# EAGLE design ATmega168 Temp Sensor - Base Unit (EAGLE 5.06)
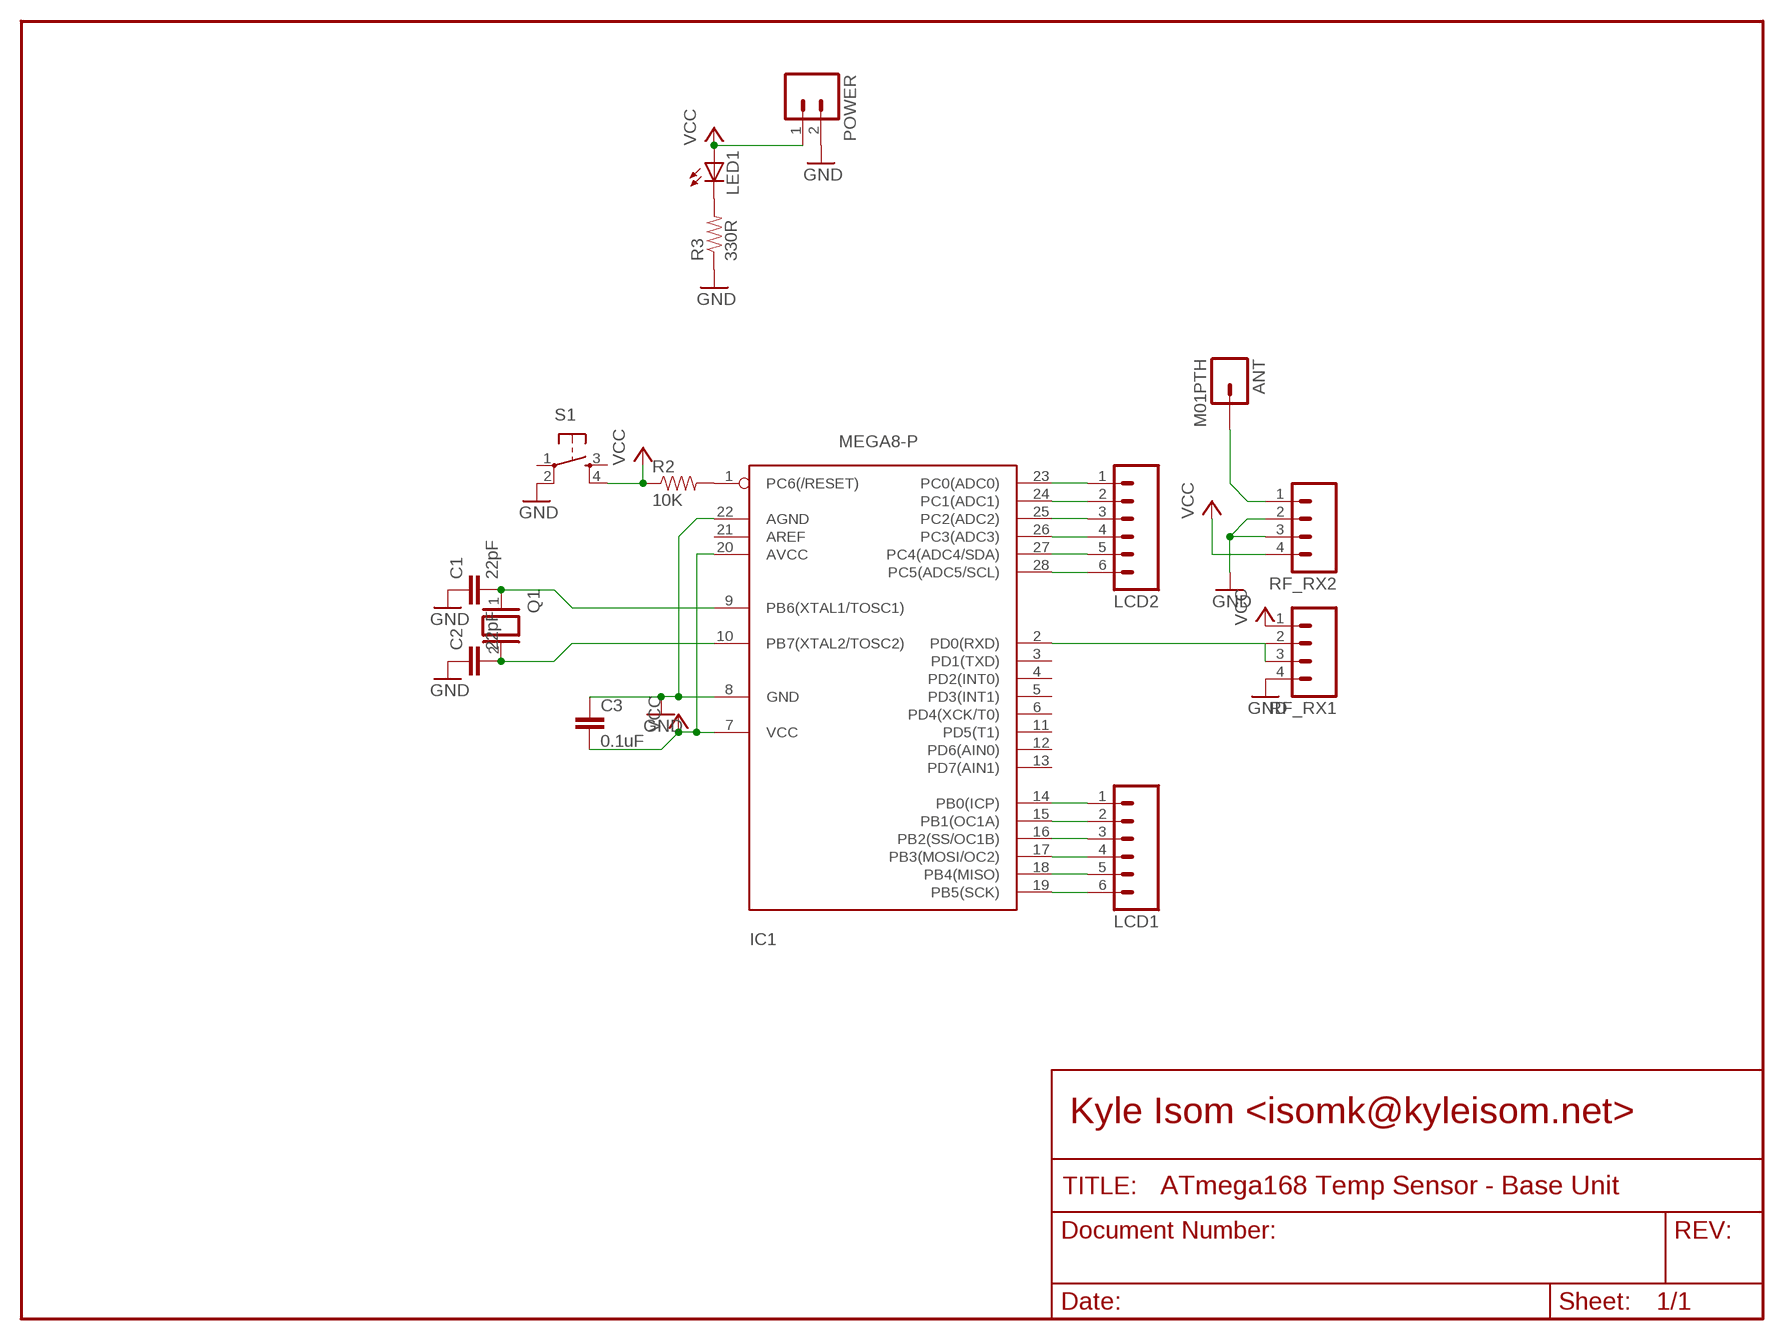
[diagram p0: schematic, sheet 1]

## Parts
ANT  M01PTH  [1X01]
C1  22pF  CAPPTH1  [CAP-PTH-5MM]
C2  22pF  CAPPTH1  [CAP-PTH-5MM]
C3  0.1uF  CAPPTH1  [CAP-PTH-5MM]
IC1  MEGA8-P  [DIL28-3]
LCD1  M06LOCK  [1X06_LOCK]
LCD2  M06LOCK  [1X06_LOCK]
LED1  LED3MM  [LED3MM]
POWER  M02LOCK  [1X02_LOCK]
Q1  XTAL/S  [QS]
R2  10K  RESISTORPTH1  [AXIAL-0.3]
R3  330R  RESISTORPTH1  [AXIAL-0.3]
RF_RX1  M04LOCK  [1X04_LOCK]
RF_RX2  M04LOCK  [1X04_LOCK]
S1  TAC_SWITCHPTH  [TACTILE-PTH]

## Nets
GND: C1.1 C2.1 C3.1 IC1.8(GND) IC1.22(AGND) POWER.2 R3.P$1 RF_RX1.4 RF_RX2.2 RF_RX2.3 S1.2
N$1: IC1.2(PD0(RXD)) RF_RX1.2 RF_RX1.3
N$2: C1.2 IC1.9(PB6(XTAL1/TOSC1)) Q1.1
N$3: C2.2 IC1.10(PB7(XTAL2/TOSC2)) Q1.2
N$4: ANT.1 RF_RX2.1
N$5: IC1.1(PC6(/RESET)) R2.P$2
N$6: IC1.28(PC5(ADC5/SCL)) LCD2.6
N$7: IC1.27(PC4(ADC4/SDA)) LCD2.5
N$8: LED1.K(C) R3.P$2
N$9: IC1.26(PC3(ADC3)) LCD2.4
N$10: IC1.25(PC2(ADC2)) LCD2.3
N$11: IC1.24(PC1(ADC1)) LCD2.2
N$12: IC1.23(PC0(ADC0)) LCD2.1
N$13: IC1.19(PB5(SCK)) LCD1.6
N$14: IC1.18(PB4(MISO)) LCD1.5
N$15: IC1.17(PB3(MOSI/OC2)) LCD1.4
N$16: IC1.16(PB2(SS/OC1B)) LCD1.3
N$17: IC1.15(PB1(OC1A)) LCD1.2
N$18: IC1.14(PB0(ICP)) LCD1.1
VCC: C3.2 IC1.7(VCC) IC1.20(AVCC) LED1.A POWER.1 R2.P$1 RF_RX1.1 RF_RX2.4 S1.4
Unconnected: IC1.3(PD1(TXD)) IC1.4(PD2(INT0)) IC1.5(PD3(INT1)) IC1.6(PD4(XCK/T0)) IC1.11(PD5(T1)) IC1.12(PD6(AIN0)) IC1.13(PD7(AIN1)) IC1.21(AREF) S1.1 S1.3

## Notes on the sheet
- Kyle Isom <isomk@kyleisom.net>

## Library data of the parts
ANT = SparkFun:M01: Header 1 Standard 1-pin 0.1" header. Use with straight break away headers (SKU : PRT-00116), right angle break away headers (PRT-00553), swiss pins (PRT-00743), machine pins (PRT-00117), and female headers (PRT-00115).
C1-C3 = SparkFun:CAP: Capacitor Standard 0603 ceramic capacitor, and 0.1" leaded capacitor.
IC1 = avr-6:MEGA8-P: MICROCONTROLLER 8 Kbytes FLASH 1 kbytes SRAM 512 bytes EEPROM USART 4-channel 10 bit ADC 2-channel 8 bit ADC
LCD1 LCD2 = SparkFun:M06: Header 6 Standard 6-pin 0.1" header. Use with straight break away headers (SKU : PRT-00116), right angle break away headers (PRT-00553), swiss pins (PRT-00743), machine pins (PRT-00117), and female headers (PRT-00115). Molex polarized connector foot print use with SKU : PRT-08094 with associated crimp pins and housings. NOTES ON THE VARIANTS LOCK and LOCK_LONGPADS... This footprint was designed to help hold the alignment of a through-hole component (i.e. 6-pin header) while soldering it into place. You may notice that each hole has been shifted either up or down by 0.005 of an inch from it's more standard position (which is a perfectly straight line). This slight alteration caused the pins (the squares in the middle) to touch the edges of the holes. Because they are alternating, it causes a "brace" to hold the component in place. 0.005 has proven to be the perfect amount of "off-center" position when using our standard breakaway headers. Although looks a little odd when you look at the bare footprint, once you have a header in there, the alteration is very hard to notice. Also, if you push a header all the way into place, it is covered up entirely on the bottom side. This idea of altering the position of holes to aid alignment will be further integrated into the Sparkfun Library for other footprints. It can help hold any component with 3 or more connection pins.
LED1 = led:LED: LED OSRAM: - CHIPLED LG R971, LG N971, LY N971, LG Q971, LY Q971, LO R971, LY R971 LH N974, LH R974 LS Q976, LO Q976, LY Q976 LO Q996 - Hyper CHIPLED LW Q18S LB Q993, LB Q99A, LB R99A - SideLED LS A670, LO A670, LY A670, LG A670, LP A670 LB A673, LV A673, LT A673, LW A673 LH A674 LY A675 LS A676, LA A676, LO A676, LY A676, LW A676 LS A679, LY A679, LG A679 - Hyper Micro SIDELED® LS Y876, LA Y876, LO Y876, LY Y876 LT Y87S - SmartLED LW L88C, LW L88S LB L89C, LB L89S, LG L890 LS L89K, LO L89K, LY L89K LS L896, LA L896, LO L896, LY L896 - TOPLED LS T670, LO T670, LY T670, LG T670, LP T670 LSG T670, LSP T670, LSY T670, LOP T670, LYG T670 LG T671, LOG T671, LSG T671 LB T673, LV T673, LT T673, LW T673 LH T674 LS T676, LA T676, LO T676, LY T676, LB T676, LH T676, LSB T676, LW T676 LB T67C, LV T67C, LT T67C, LS T67K, LO T67K, LY T67K, LW E67C LS E67B, LA E67B, LO E67B, LY E67B, LB E67C, LV E67C, LT E67C LW T67C LS T679, LY T679, LG T679 LS T770, LO T770, LY T770, LG T770, LP T770 LB T773, LV T773, LT T773, LW T773 LH T774 LS E675, LA E675, LY E675, LS T675 LS T776, LA T776, LO T776, LY T776, LB T776 LHGB T686 LT T68C, LB T68C - Hyper Mini TOPLED® LB M676 - Mini TOPLED Santana® LG M470 LS M47K, LO M47K, LY M47K Source: http://www.osram.convergy.de LUXEON: - LUMILED® LXK2-PW12-R00, LXK2-PW12-S00, LXK2-PW14-U00, LXK2-PW14-V00 LXK2-PM12-R00, LXK2-PM12-S00, LXK2-PM14-U00 LXK2-PE12-Q00, LXK2-PE12-R00, LXK2-PE12-S00, LXK2-PE14-T00, LXK2-PE14-U00 LXK2-PB12-K00, LXK2-PB12-L00, LXK2-PB12-M00, LXK2-PB14-N00, LXK2-PB14-P00, LXK2-PB14-Q00 LXK2-PR12-L00, LXK2-PR12-M00, LXK2-PR14-Q00, LXK2-PR14-R00 LXK2-PD12-Q00, LXK2-PD12-R00, LXK2-PD12-S00 LXK2-PH12-R00, LXK2-PH12-S00 LXK2-PL12-P00, LXK2-PL12-Q00, LXK2-PL12-R00 Source: www.luxeon.com KINGBRIGHT: KA-3528ASYC Source: www.kingbright.com
POWER = SparkFun:M02: Header 2 Standard 2-pin 0.1" header. Use with straight break away headers (SKU : PRT-00116), right angle break away headers (PRT-00553), swiss pins (PRT-00743), machine pins (PRT-00117), and female headers (PRT-00115). Molex polarized connector foot print use with SKU : PRT-08233 with associated crimp pins and housings.
Q1 = special:XTAL/S: CRYSTAL
R2 R3 = SparkFun:RESISTOR: Resistor Basic schematic elements and footprints for 0603, 1206, and PTH 1/10th watt (small) resistors.
RF_RX1 RF_RX2 = SparkFun:M04: Header 4 Standard 4-pin 0.1" header. Use with straight break away headers (SKU : PRT-00116), right angle break away headers (PRT-00553), swiss pins (PRT-00743), machine pins (PRT-00117), and female headers (PRT-00115). Molex polarized connector foot print use with SKU : PRT-08231 with associated crimp pins and housings.
S1 = SparkFun:TAC_SWITCH: Momentary Switch Button commonly used for reset or general input. Spark Fun Electronics SKU : COM-00097

## Board
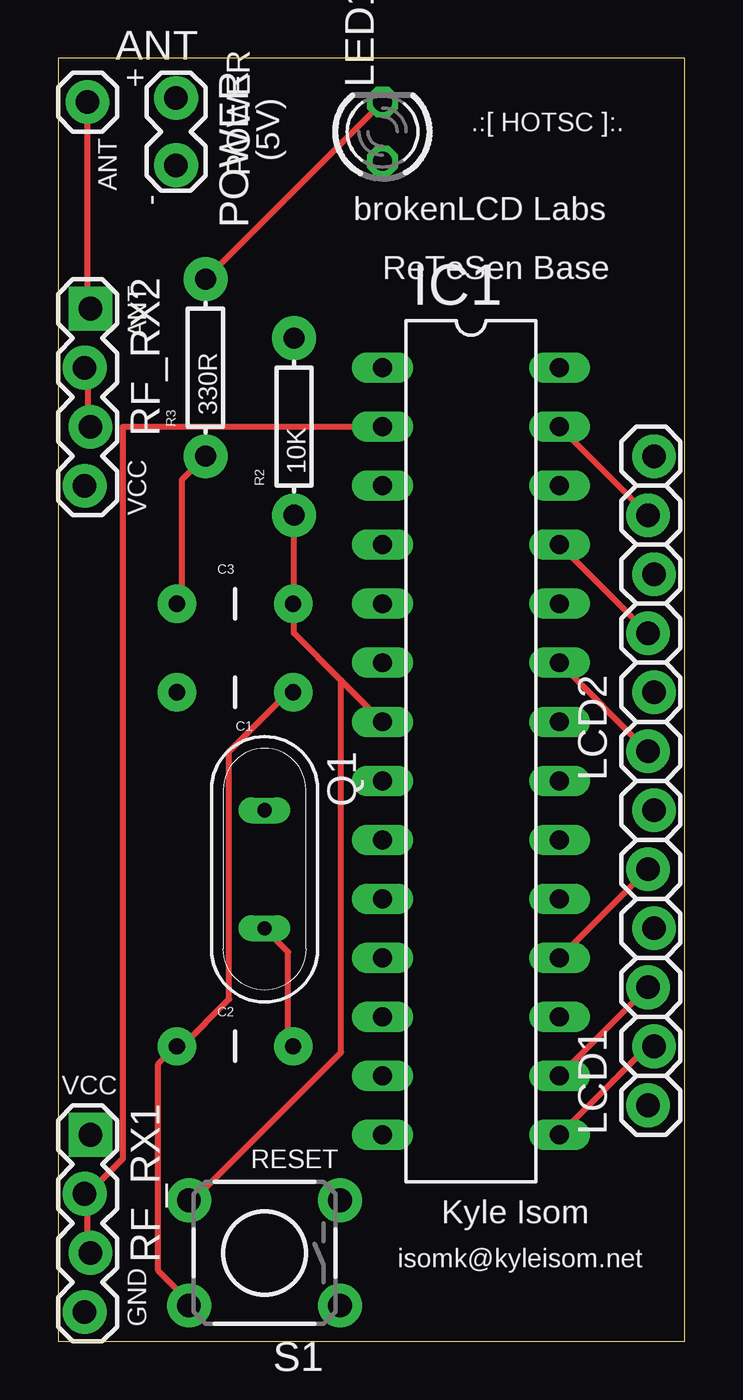
[diagram p1: board, top side]
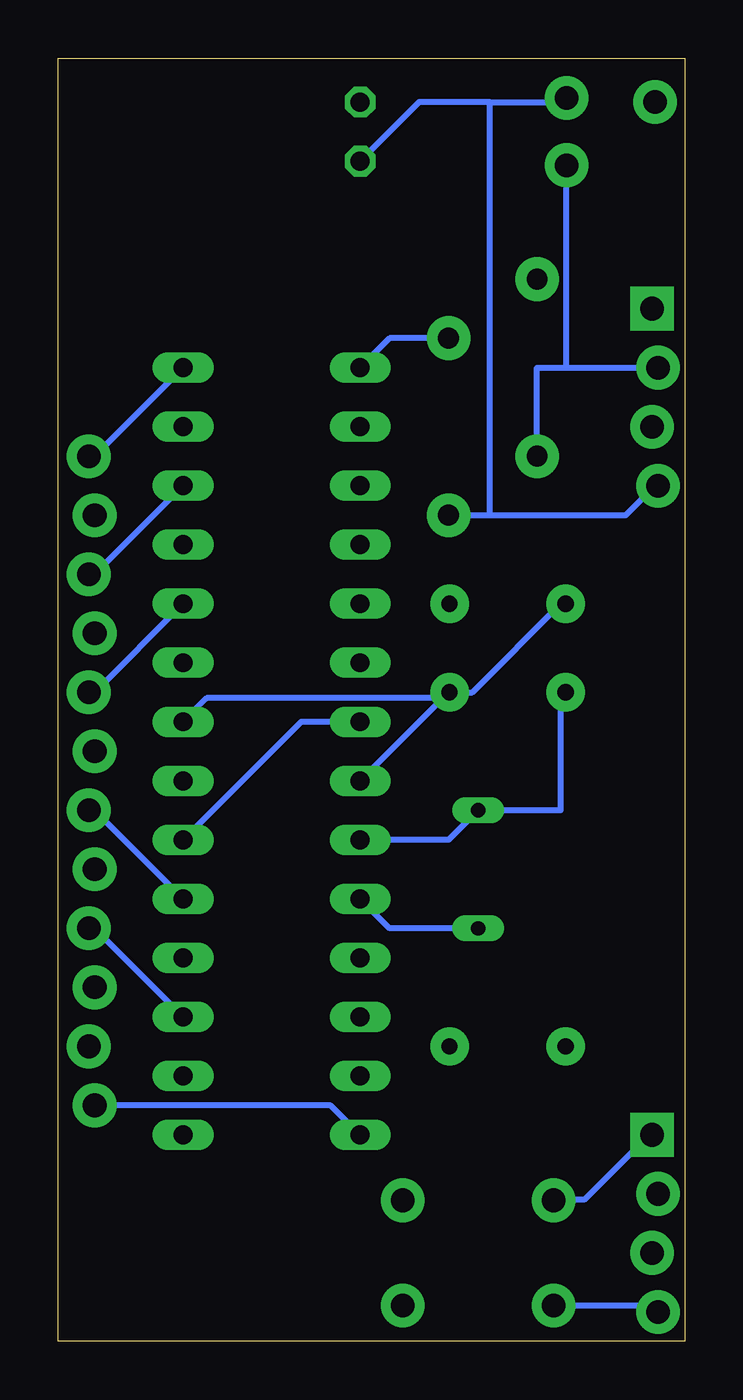
[diagram p2: board, bottom side, seen from below]

Size 26.98 x 55.23 mm. Coordinates in mm from the lower left corner, seen from the top.
Outline: 0,0 26.98,0 26.98,55.23 0,55.23 0,0
Copper layers (1*16): Top 0.035mm / dielectric 1.5mm / Bottom 0.035mm
Design rules "default": minimum track width 10mil, minimum drill 24mil, track to track 8mil, track to pad 8mil, pad to pad 8mil, via to via 8mil, smd to smd 8mil, copper to edge 40mil, drill to drill 8mil, minimum pad ring 10mil, minimum via ring 8mil, stop-mask expansion 4mil, vias tented up to drill 0mil, thermal gap 10mil

### Footprints (pad centres in the part's own frame; a part is rotated, then mirrored left to right if it is on the bottom)
1X01 = drill 1.016 pad 1.88 round: 1 0,0
CAP-PTH-5MM = drill 0.7 pad 1.651 round: 1 -2.5,0; 2 2.5,0
DIL28-3 = drill 0.813 long: 1 -16.51,-3.81; 2 -13.97,-3.81; 3 -11.43,-3.81; 4 -8.89,-3.81; 5 -6.35,-3.81; 6 -3.81,-3.81; 7 -1.27,-3.81; 8 1.27,-3.81; 9 3.81,-3.81; 10 6.35,-3.81; 11 8.89,-3.81; 12 11.43,-3.81; 13 13.97,-3.81; 14 16.51,-3.81; 15 16.51,3.81; 16 13.97,3.81; 17 11.43,3.81; 18 8.89,3.81; 19 6.35,3.81; 20 3.81,3.81; 21 1.27,3.81; 22 -1.27,3.81; 23 -3.81,3.81; 24 -6.35,3.81; 25 -8.89,3.81; 26 -11.43,3.81; 27 -13.97,3.81; 28 -16.51,3.81
1X06_LOCK = drill 1.016 pad 1.88 round: 1 0,0; 2 2.54,-0.254; 3 5.08,0; 4 7.62,-0.254; 5 10.16,0; 6 12.7,-0.254
LED3MM = drill 0.813 octagon: A -1.27,0; K 1.27,0
1X02_LOCK = drill 1.016 pad 1.88 round: 1 -0.178,0; 2 2.718,0
QS = drill 0.61 long: 1 -2.54,0; 2 2.54,0
AXIAL-0.3 = drill 0.9 pad 1.88 round: P$1 -3.81,0; P$2 3.81,0
1X04_LOCK = drill 1.016 pad 1.88 square: 1 0,0.127 | drill 1.016 pad 1.88 round: 2 2.54,-0.127; 3 5.08,0.127; 4 7.62,-0.127
TACTILE-PTH = drill 1.016 pad 1.88 round: 1 -3.251,2.261; 2 3.251,2.261; 3 -3.251,-2.261; 4 3.251,-2.261

### Placement (x,y rotation side)
ANT  1.27,53.34 0 top
C1  7.62,27.94 180 top
C2  7.62,12.7 0 top
C3  7.62,31.75 0 top
IC1  17.78,25.4 270 top
LCD1  25.4,10.16 90 top
LCD2  25.4,25.4 90 top
LED1  13.97,52.07 90 top
POWER  5.08,53.34 270 top
Q1  8.89,20.32 270 top
R2  10.16,39.37 90 top
R3  6.35,41.91 90 top
RF_RX1  1.27,8.89 270 top
RF_RX2  1.27,44.45 270 top
S1  8.89,3.81 180 top

### Tracks (layer width: path | path; a pad name or v marks a point on that pad's centre or on a via)
GND
  Top 0.254: RF_RX2.2 1.27,41.91 1.27,39.37 RF_RX2.3 | S1.2 5.59,1.78 4.32,3.05 4.32,11.94 5.08,12.7 C2.1 5.33,12.7 7.37,14.73 7.37,25.4 9.91,27.94 C1.1 | R3.P$1 5.33,37.08 5.33,31.75 C3.1
  Bottom 0.254: 5.08,41.91 POWER.2 | 5.08,41.91 RF_RX2.2 | R3.P$1 6.35,41.91 5.08,41.91 | RF_RX1.4 1.27,1.27 1.52,1.52 5.59,1.52 S1.2 | 10.41,27.69 10.16,27.94 C1.1 | 10.41,27.69 IC1.8 | IC1.22 20.57,27.69 10.41,27.69 | C1.1 10.41,27.69 | C3.1 5.33,31.75 9.14,27.94 C1.1
N$1
  Top 0.254: IC1.2 2.79,39.37 2.79,7.87 1.27,6.35 | 1.27,6.35 1.27,3.81 RF_RX1.3 | 1.27,6.35 RF_RX1.2
N$2
  Bottom 0.254: IC1.9 10.16,21.59 Q1.1 5.33,22.86 5.33,27.94 C1.2
N$3
  Top 0.254: Q1.2 9.91,16.76 9.91,12.7 C2.2
  Bottom 0.254: IC1.10 12.7,17.78 Q1.2
N$4
  Top 0.254: ANT.1 1.27,44.45 RF_RX2.1
N$5
  Bottom 0.254: IC1.1 12.7,43.18 R2.P$2
N$6
  Bottom 0.254: IC1.28 25.4,38.1 LCD2.6
N$7
  Top 0.254: IC1.27 LCD2.5
N$8
  Top 0.254: R3.P$2 LED1.K
N$9
  Bottom 0.254: IC1.26 25.4,33.02 LCD2.4
N$10
  Top 0.254: IC1.25 LCD2.3
N$11
  Bottom 0.254: IC1.24 25.4,27.94 LCD2.2
N$12
  Top 0.254: IC1.23 LCD2.1
N$13
  Bottom 0.254: IC1.19 25.4,22.86 LCD1.6
N$14
  Top 0.254: IC1.18 LCD1.5
N$15
  Bottom 0.254: IC1.17 25.4,17.78 LCD1.4
N$16
  Top 0.254: IC1.16 LCD1.3
N$17
  Top 0.254: IC1.15 25.4,12.7 LCD1.2
N$18
  Bottom 0.254: IC1.14 15.24,10.16 LCD1.1
VCC
  Top 0.254: 12.19,28.45 10.16,30.48 10.16,31.75 | 12.19,28.45 IC1.7 | 10.16,31.75 R2.P$1 | 10.16,31.75 C3.2 | 12.19,28.45 12.19,12.45 5.84,6.1 S1.4
  Bottom 0.254: LED1.A 11.43,53.34 8.38,53.34 | 8.38,53.34 5.08,53.34 POWER.1 | RF_RX1.1 1.52,8.89 4.32,6.1 5.59,6.1 S1.4 | IC1.20 16.51,26.67 IC1.7 | R2.P$1 8.38,35.56 | 8.38,35.56 2.54,35.56 1.27,36.83 RF_RX2.4 | 8.38,35.56 8.38,53.34

### Text on the board
tPlace: + | .:[ HOTSC ]:. | (5V) | ANT | POWER | - | brokenLCD Labs | ReTeSen Base | ANT | VCC | VCC | RESET | Kyle Isom | isomk@kyleisom.net | GND